# EAGLE design LB_w19_SPLIT_IN-v03(rev2_2)-OHW (EAGLE 6.6.0)

## Sheet 1 of 2
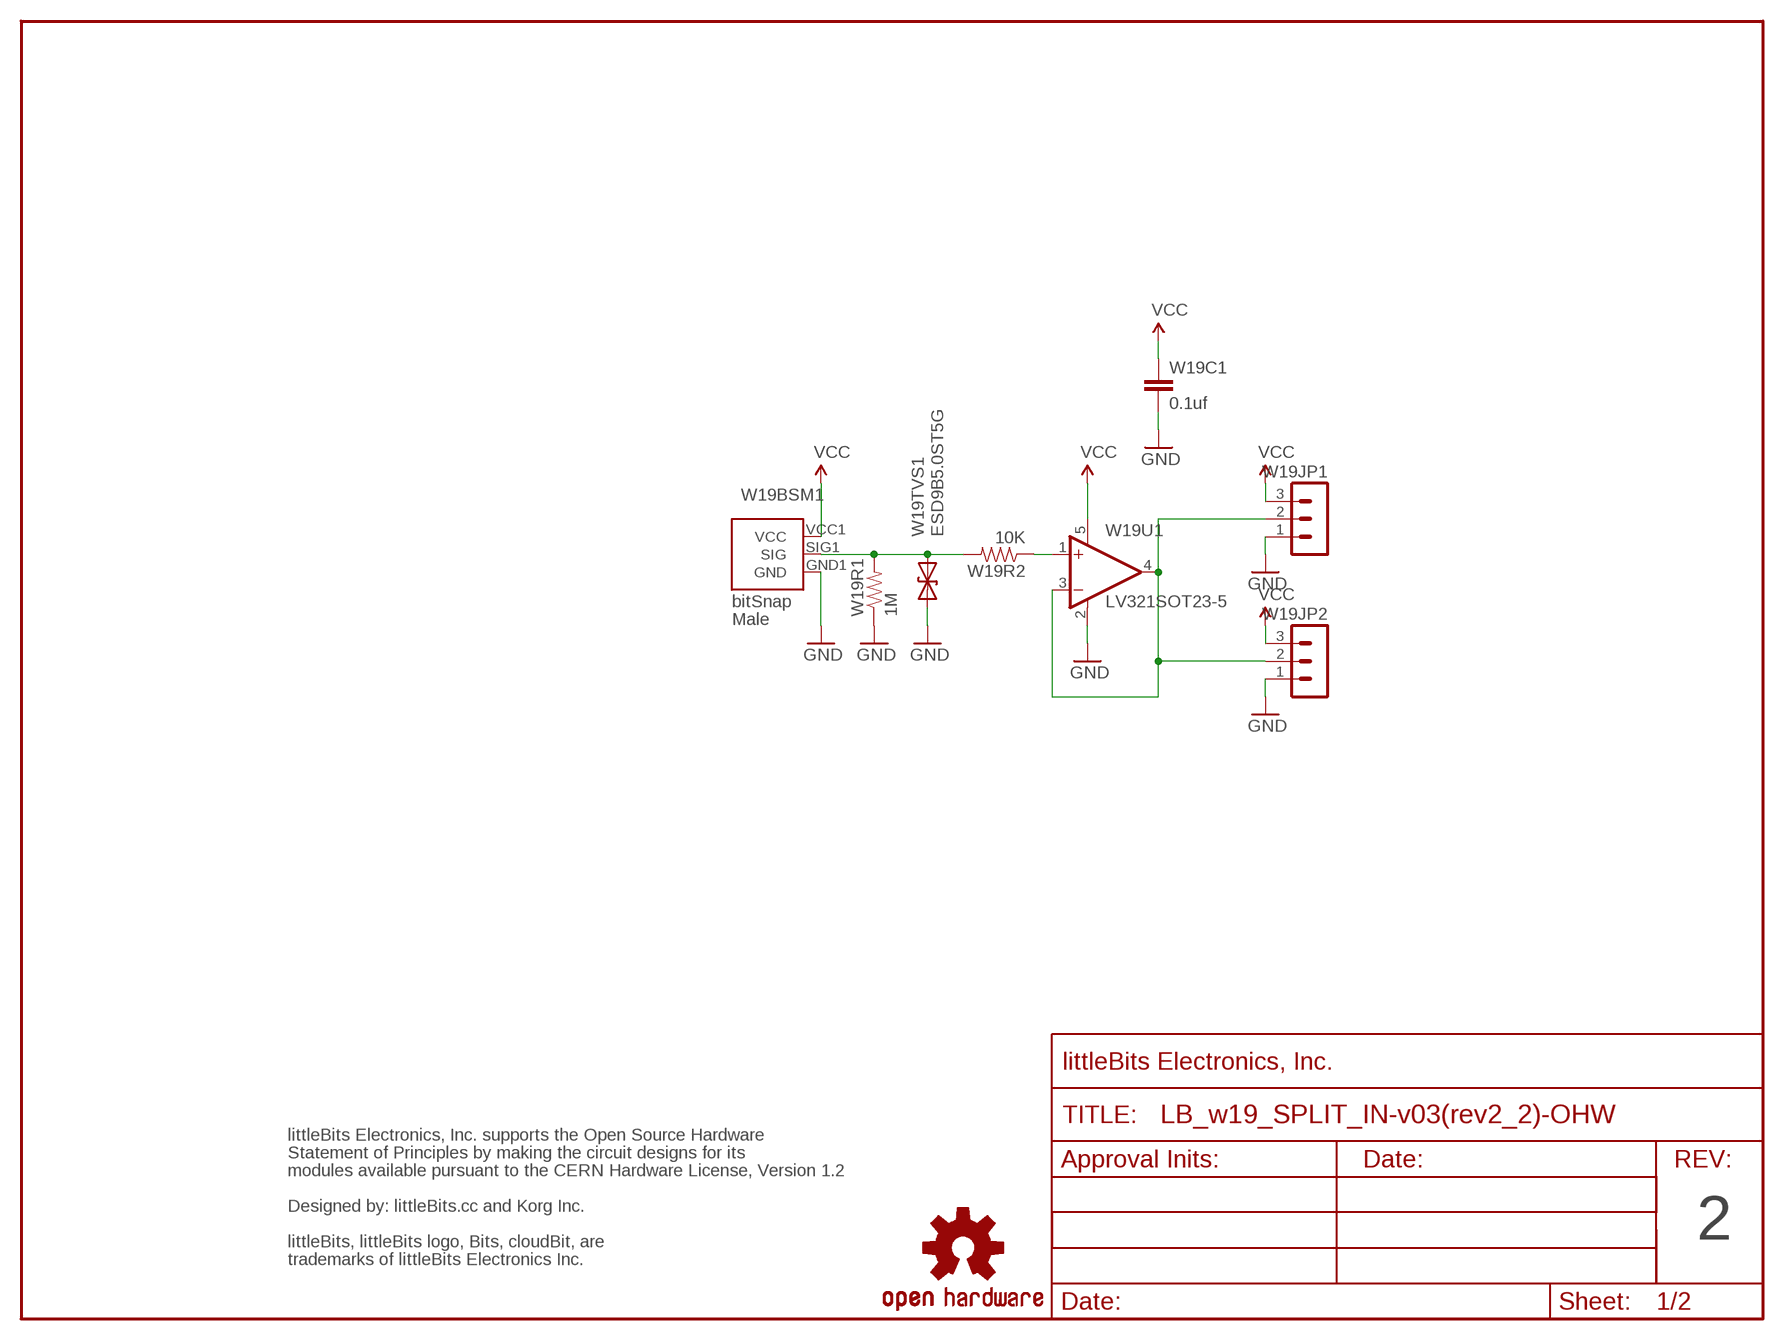
[diagram p0: schematic, sheet 1]

### Parts
FRAME1  FRAME-LETTER-OHWOHW  [FABDWG01-OHW]
U$1  OSHWCREDIT-KORG  [OSHWCREDIT-KORG]
U$3  OSHW-LOGOL  [OSHW-LOGO-L]
W19BSM1  BITSNAP_V03_MALE  [BITSNAP_V03_MALE]
W19C1  0.1uf  CAPCAP-0603  [CAP-0603]
W19JP1  MA03-1SMD  [1X03-1MM-RA]
W19JP2  MA03-1SMD  [1X03-1MM-RA]
W19R1  1M  RESISTOR0603  [RES-0603]
W19R2  10K  RESISTOR0603  [RES-0603]
W19TVS1  ESD9B5.0ST5G  DIODE-TVSSOD-923  [SOD-923]
W19U1  LV321SOT23-5  [SOT23-5]

### Nets
GND: W19BSM1.GND1(GND) W19C1.2 W19JP1.1 W19JP2.1 W19R1.1 W19TVS1.1(A) W19U1.2(V-)
N$1: W19BSM1.SIG1(SIG) W19R1.2 W19R2.2 W19TVS1.2(C)
N$2: W19R2.1 W19U1.1(+IN)
N$3: W19JP1.2 W19JP2.2 W19U1.3(-IN) W19U1.4(OUT)
VCC: W19BSM1.VCC1(VCC) W19C1.1 W19JP1.3 W19JP2.3 W19U1.5(V+)

### Notes on the sheet
- 2

## Sheet 2 of 2

## Library data of the parts
FRAME1 = LITTLEBITS:FRAME-LETTER-OHW
U$1 = LITTLEBITS:OSHWCREDIT-KORG
U$3 = SparkFun:OSHW-LOGO: Open Source Hardware Logo This logo indicates the piece of hardware it is found on incorporates a OSHW license and/or adheres to the definition of open source hardware found here: http://freedomdefined.org/OSHW
W19BSM1 = bitSnap:BITSNAP_V03_MALE
W19C1 = LITTLEBITS:CAP
W19JP1 W19JP2 = LITTLEBITS:MA03-1: PIN HEADER
W19R1 W19R2 = LITTLEBITS:RESISTOR
W19TVS1 = LITTLEBITS:DIODE-TVS: Bidirectional Transient Voltage Suppression Diode: Device conducts in avalanche mode after reaching a part dependent voltage threshold. Used for limiting voltage spikes on ESD sensitive inputs and outputs.; IEC_ESD_PROT0: +/-18kV; LB_PN: ?; MPN: ESD9B5.0ST5G; V_CLAMP: ?; V_OPERATION: 5V
W19U1 = LITTLEBITS:LV321

## Board
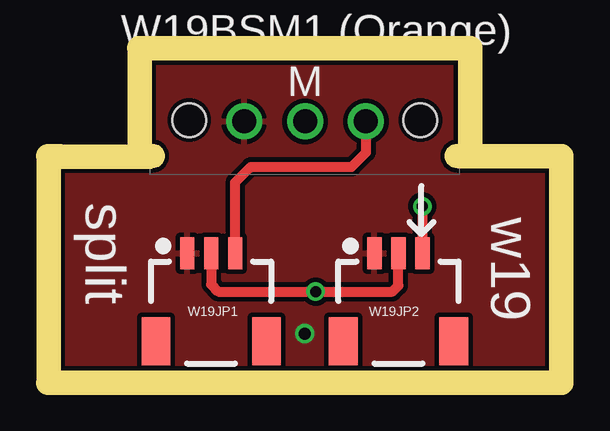
[diagram p1: board, top side]
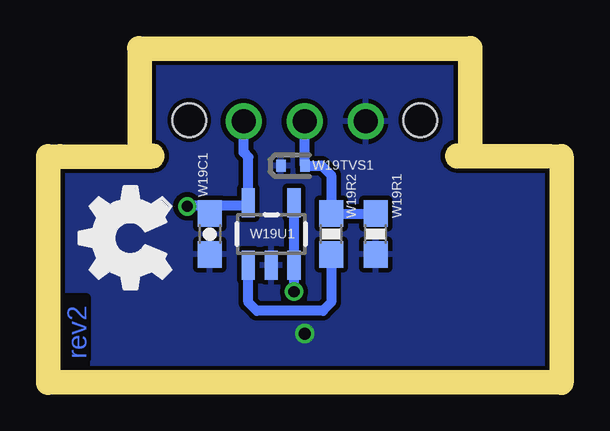
[diagram p2: board, bottom side, seen from below]

Size 20.4 x 12.95 mm. Coordinates in mm from the lower left corner, seen from the top.
Outline: 0,8.45 0,0 20.4,0 20.4,8.45
Copper layers (1*16): Top 0.035mm / dielectric 1.5mm / Bottom 0.035mm
Design rules "littleBitsDRC": minimum track width 0.2mm, minimum drill 0.4mm, track to track 0.2mm, track to pad 0.2mm, pad to pad 0.2mm, via to via 0.2mm, smd to smd 0mil, copper to edge 0.2mm, drill to drill 0.2mm, minimum pad ring 0.2mm, minimum via ring 0.15mm, stop-mask expansion 0.1mm, vias tented up to drill 0mil, thermal gap 0.2mm
Milling: 5 lines

### Footprints (pad centres in the part's own frame; a part is rotated, then mirrored left to right if it is on the bottom)
BITSNAP_V03_MALE = drill 1: GND1 8.98,2.56; SIG1 6.44,2.56; VCC1 3.9,2.56 | hole 1.4: 11.27,2.5; 1.63,2.5
CAP-0603 = smd 1.1 x 1: 1 -0.85,0; 2 0.85,0
1X03-1MM-RA = smd 0.6 x 1.35: 1 -1,0; 2 0,0; 3 1,0 | smd 1.2 x 2: NC1 2.3,-3.675; NC2 -2.3,-3.675
RES-0603 = smd 1.1 x 1: 1 -0.85,0; 2 0.85,0
SOD-923 = smd 0.4 x 0.5: 1 -0.5,0; 2 0.5,0
SOT23-5 = smd 0.55 x 1.2: 1 -0.95,-1.3; 2 0,-1.3; 3 0.95,-1.3; 4 0.95,1.3; 5 -0.95,1.3

### Placement (x,y rotation side)
E$1  [FABDWG01-OHW]  0.01,0 0 top
E$2  [OSHWCREDIT-KORG]  -60.19,-78.53 0 top  (outside the outline)
U$2  [OSHW_FILLX150_NOTEXT]  15.79,2.58 0 top
U$3  -25.64,-71.14 0 top  (outside the outline)
W19BSM1  16.65,12.95 180 top
W19C1  14.16,5.7 270 bottom
W19JP1  6.3,4.9 0 top
W19JP2  14.1,4.9 0 top
W19R1  7.25,5.7 90 bottom
W19R2  9.1,5.7 90 bottom
W19TVS1  10.7,8.55 0 bottom
W19U1  11.6,5.7 0 bottom

### Tracks (layer width: path | path; a pad name or v marks a point on that pad's centre or on a via)
GND  (via drill 0.5)
  other vias: 10.2,1.55
  pour Top: 0.15,12.8 0.15,0.15 20.25,0.15 20.25,12.8
  pour Bottom: 0.15,12.8 20.25,12.8 20.25,0.15 0.15,0.15
N$1
  Bottom 0.406: W19BSM1.SIG1 W19TVS1.2 9.5,8.55 9.1,8.15 W19R2.2 W19R1.2
N$2
  Bottom 0.406: W19R2.1 9.1,2.85 9.45,2.5 12.2,2.5 12.55,2.85 W19U1.1
N$3  (via drill 0.46)
  Top 0.406: W19JP2.2 14.1,3.55 13.85,3.3 v10.65,3.3 6.6,3.3 6.3,3.6 W19JP1.2
  Bottom 0.406: W19U1.4 W19U1.3 v10.65,3.3
VCC  (via drill 0.46)
  Top 0.406: v15.1,6.85 W19JP2.3 | W19JP1.3 7.3,7.85 7.95,8.5 12.15,8.5 12.75,9.1 W19BSM1.VCC1
  Bottom 0.406: W19BSM1.VCC1 12.75,9.1 12.55,8.9 W19U1.5 12.55,7.05 12.73,6.87 14.13,6.88 | 14.13,6.88 W19C1.1 | 14.13,6.88 15.11,6.88 v15.1,6.85

### Text on the board
Bottom: rev2
tPlace: split | w19
tNames: W19BSM1 (Orange)
dxf: 2